# Altium schematic sheet Sheet1.SchDoc
size A; SheetNumber: 1; SheetTotal: 1
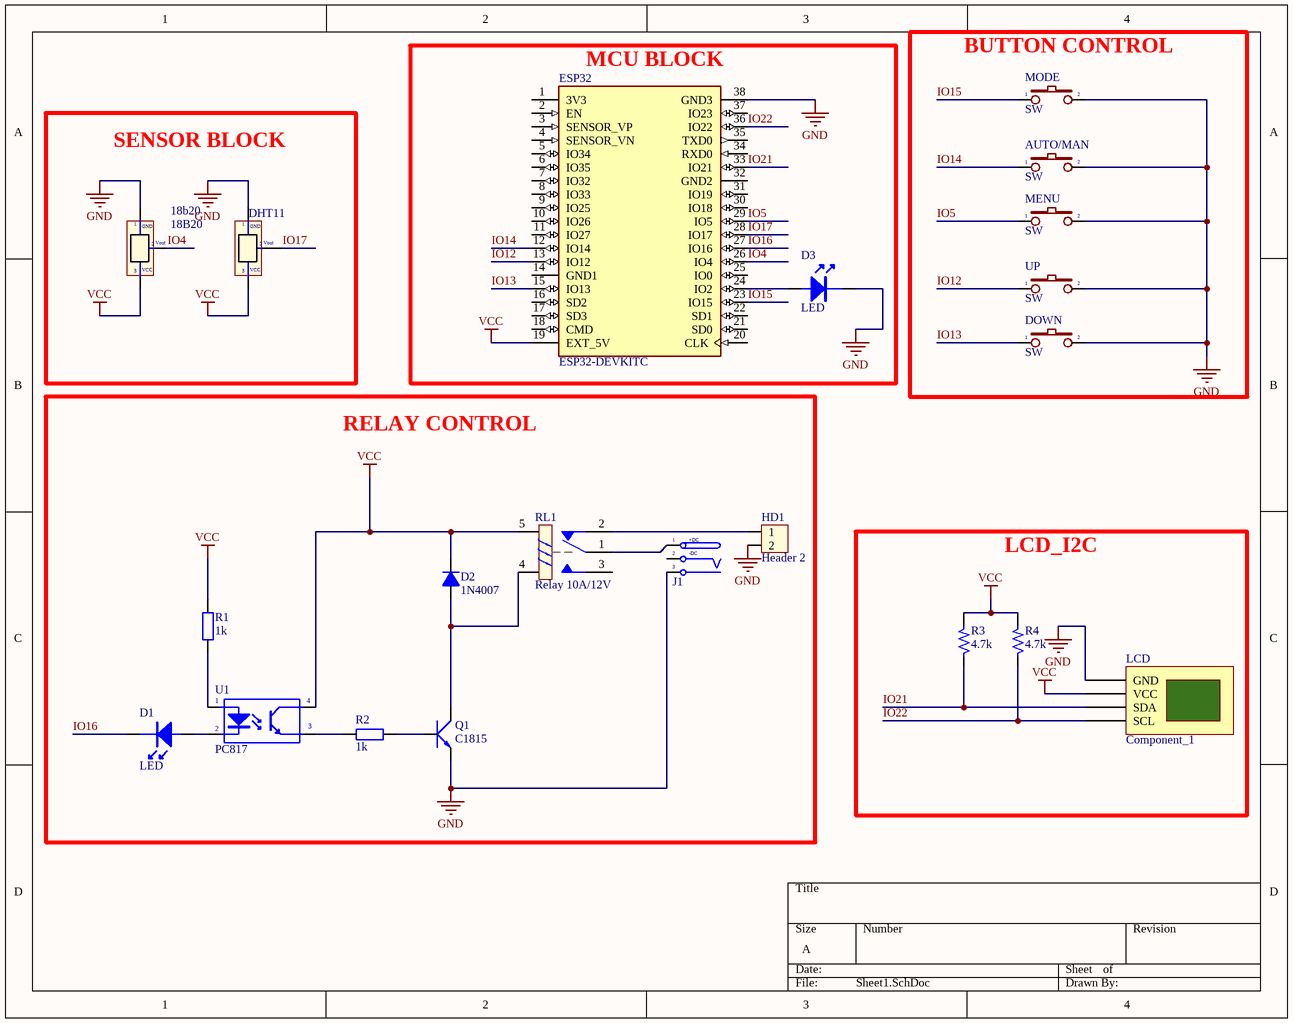
[diagram p0: Sheet1.SchDoc]

## Parts
18b20  18B20  [HED3]
AUTO/MAN  SW  [SW2]
D1  LED  [CAP10UF]
D2  1N4007  [D1A]
D3  LED  [CAP10UF]
DHT11  Component_1  [Jumper 3]  (value not drawn)
DOWN  SW  [SW2]
ESP32  ESP32-DEVKITC  [MODULE_ESP32-DEVKITC]
HD1  Header 2  [HED2]
J1  JACK DC 5MM  [JACK DC 5MM]  (value not drawn)
LCD  Component_1  [Jumper 4]
MENU  SW  [SW2]
MODE  SW  [SW2]
Q1  C1815  [TO126]
R1  1k  [R1/4W]
R2  1k  [R1/4W]
R3  4.7k  [R1/6W]
R4  4.7k  [R1/6W]
RL1  Relay 10A/12V  [RL_SPDT_10A]
U1  PC817  [DIP4/W0.3]
UP  SW  [SW2]

## Blocks framed on the sheet
MCU BLOCK: D3 ESP32
BUTTON CONTROL: AUTO/MAN DOWN MENU MODE UP
SENSOR BLOCK: 18b20 DHT11
RELAY CONTROL: D1 D2 HD1 J1 Q1 R1 R2 RL1 U1
LCD_I2C: LCD R3 R4

## Nets
GND: 18b20.1(GND) AUTO/MAN.2 D3.2 DHT11.1(GND) DOWN.2 ESP32.38(GND3) HD1.2 J1.3(S) LCD.1(GND) MENU.2 MODE.2 Q1.3(E) UP.2
VCC: 18b20.3(V+) D2.2(K) DHT11.3(V+) ESP32.19(EXT_5V) LCD.2(VCC) R1.1 R3.2 R4.2 RL1.5 U1.4(C)
IO4: 18b20.2(Vout) ESP32.26(IO4)
IO5: ESP32.29(IO5) MENU.1
IO12: ESP32.13(IO12) UP.1
IO13: DOWN.1 ESP32.15(IO13)
IO14: AUTO/MAN.1 ESP32.12(IO14)
IO15: ESP32.23(IO15) MODE.1
IO16: D1.2 ESP32.27(IO16)
IO17: DHT11.2(Vout) ESP32.28(IO17)
IO21: ESP32.33(IO21) LCD.3(SDA) R3.1
IO22: ESP32.36(IO22) LCD.4(SCL) R4.1
NetD1_1: D1.1 U1.2(K)
NetD2_1: D2.1(A) Q1.2(C) RL1.4
NetD3_1: D3.1 ESP32.24(IO2)
NetHD1_1: HD1.1 RL1.2
NetJ1_1: J1.1(T) RL1.1
NetQ1_1: Q1.1(B) R2.2
NetR1_2: R1.2 U1.1(A)
NetR2_1: R2.1 U1.3(E)

Not connected (* = marked no-connect by the designer): ESP32 1(3V3) 2(EN) 3(SENSOR_VP) 4(SENSOR_VN) 5(IO34) 6(IO35) 7(IO32) 8(IO33) 9(IO25) 10(IO26) 11(IO27) 14(GND1) 16(SD2) 17(SD3) 18(CMD) 20(CLK) 21(SD0) 22(SD1) 25(IO0) 30(IO18) 31(IO19) 32(GND2) 34(RXD0) 35(TXD0) 37(IO23); J1 2(TN); RL1 3

## Notes on the sheet
- (in symbol 18B20) VCC
- (in symbol Component_1) VCC
- (in symbol JACK DC 5MM) +DC; -DC

## Library data of the parts
AUTO/MAN DOWN MENU MODE UP = SW2: Switch button 2 pin; Value: SW chip 2 pin
D2 = D1A: Diode 1A; Value: 1N4007
ESP32 = ESP32-DEVKITC: ESP32-WROOM-32UE series Transceiver; 802.11 b/g/n (Wi-Fi, WiFi, WLAN), Bluetooth Â® Smart Ready 4.x Dual Mode Evaluation Board; MF: Espressif Systems; SnapEDA_Link: https://www.snapeda.com/parts/ESP32-DEVKITC/Espressif+Systems/view-part/?ref=snap; Package: None; Value: *; MP: ESP32-DEVKITC; Check_prices: https://www.snapeda.com/parts/ESP32-DEVKITC/Espressif+Systems/view-part/?ref=eda
HD1 = Hed2: Header 2 (Green); Value: Header 2
Q1 = C1815: NPN 600mW, ECB; Value: C1815
R1 R2 = R1/4W: Resistor 1/4W; Value: R1/4W - 1K
R3 R4 = Res: Resistor 1/4W; Value: R1/4W - 1K
RL1 = Relay 1: Relay SPDT,10A - 12VDC 5 Pin; Value: Relay SPDT, 10A, 12V
U1 = PC817_1: Single Opto; Value: PC817